# Altium schematic sheet USB Type C.SchDoc: USB Type C
size Tabloid; ApprovedBy: NA; CompanyName: Cospan Design LLC; DrawnBy: David McCoy; Engineer: David McCoy; DocumentNumber: 6; Revision: D; SheetNumber: 6; SheetTotal: 18; Client: OSH; ProjectPrettyName: Guppy Buddy; Project: Guppy Buddy
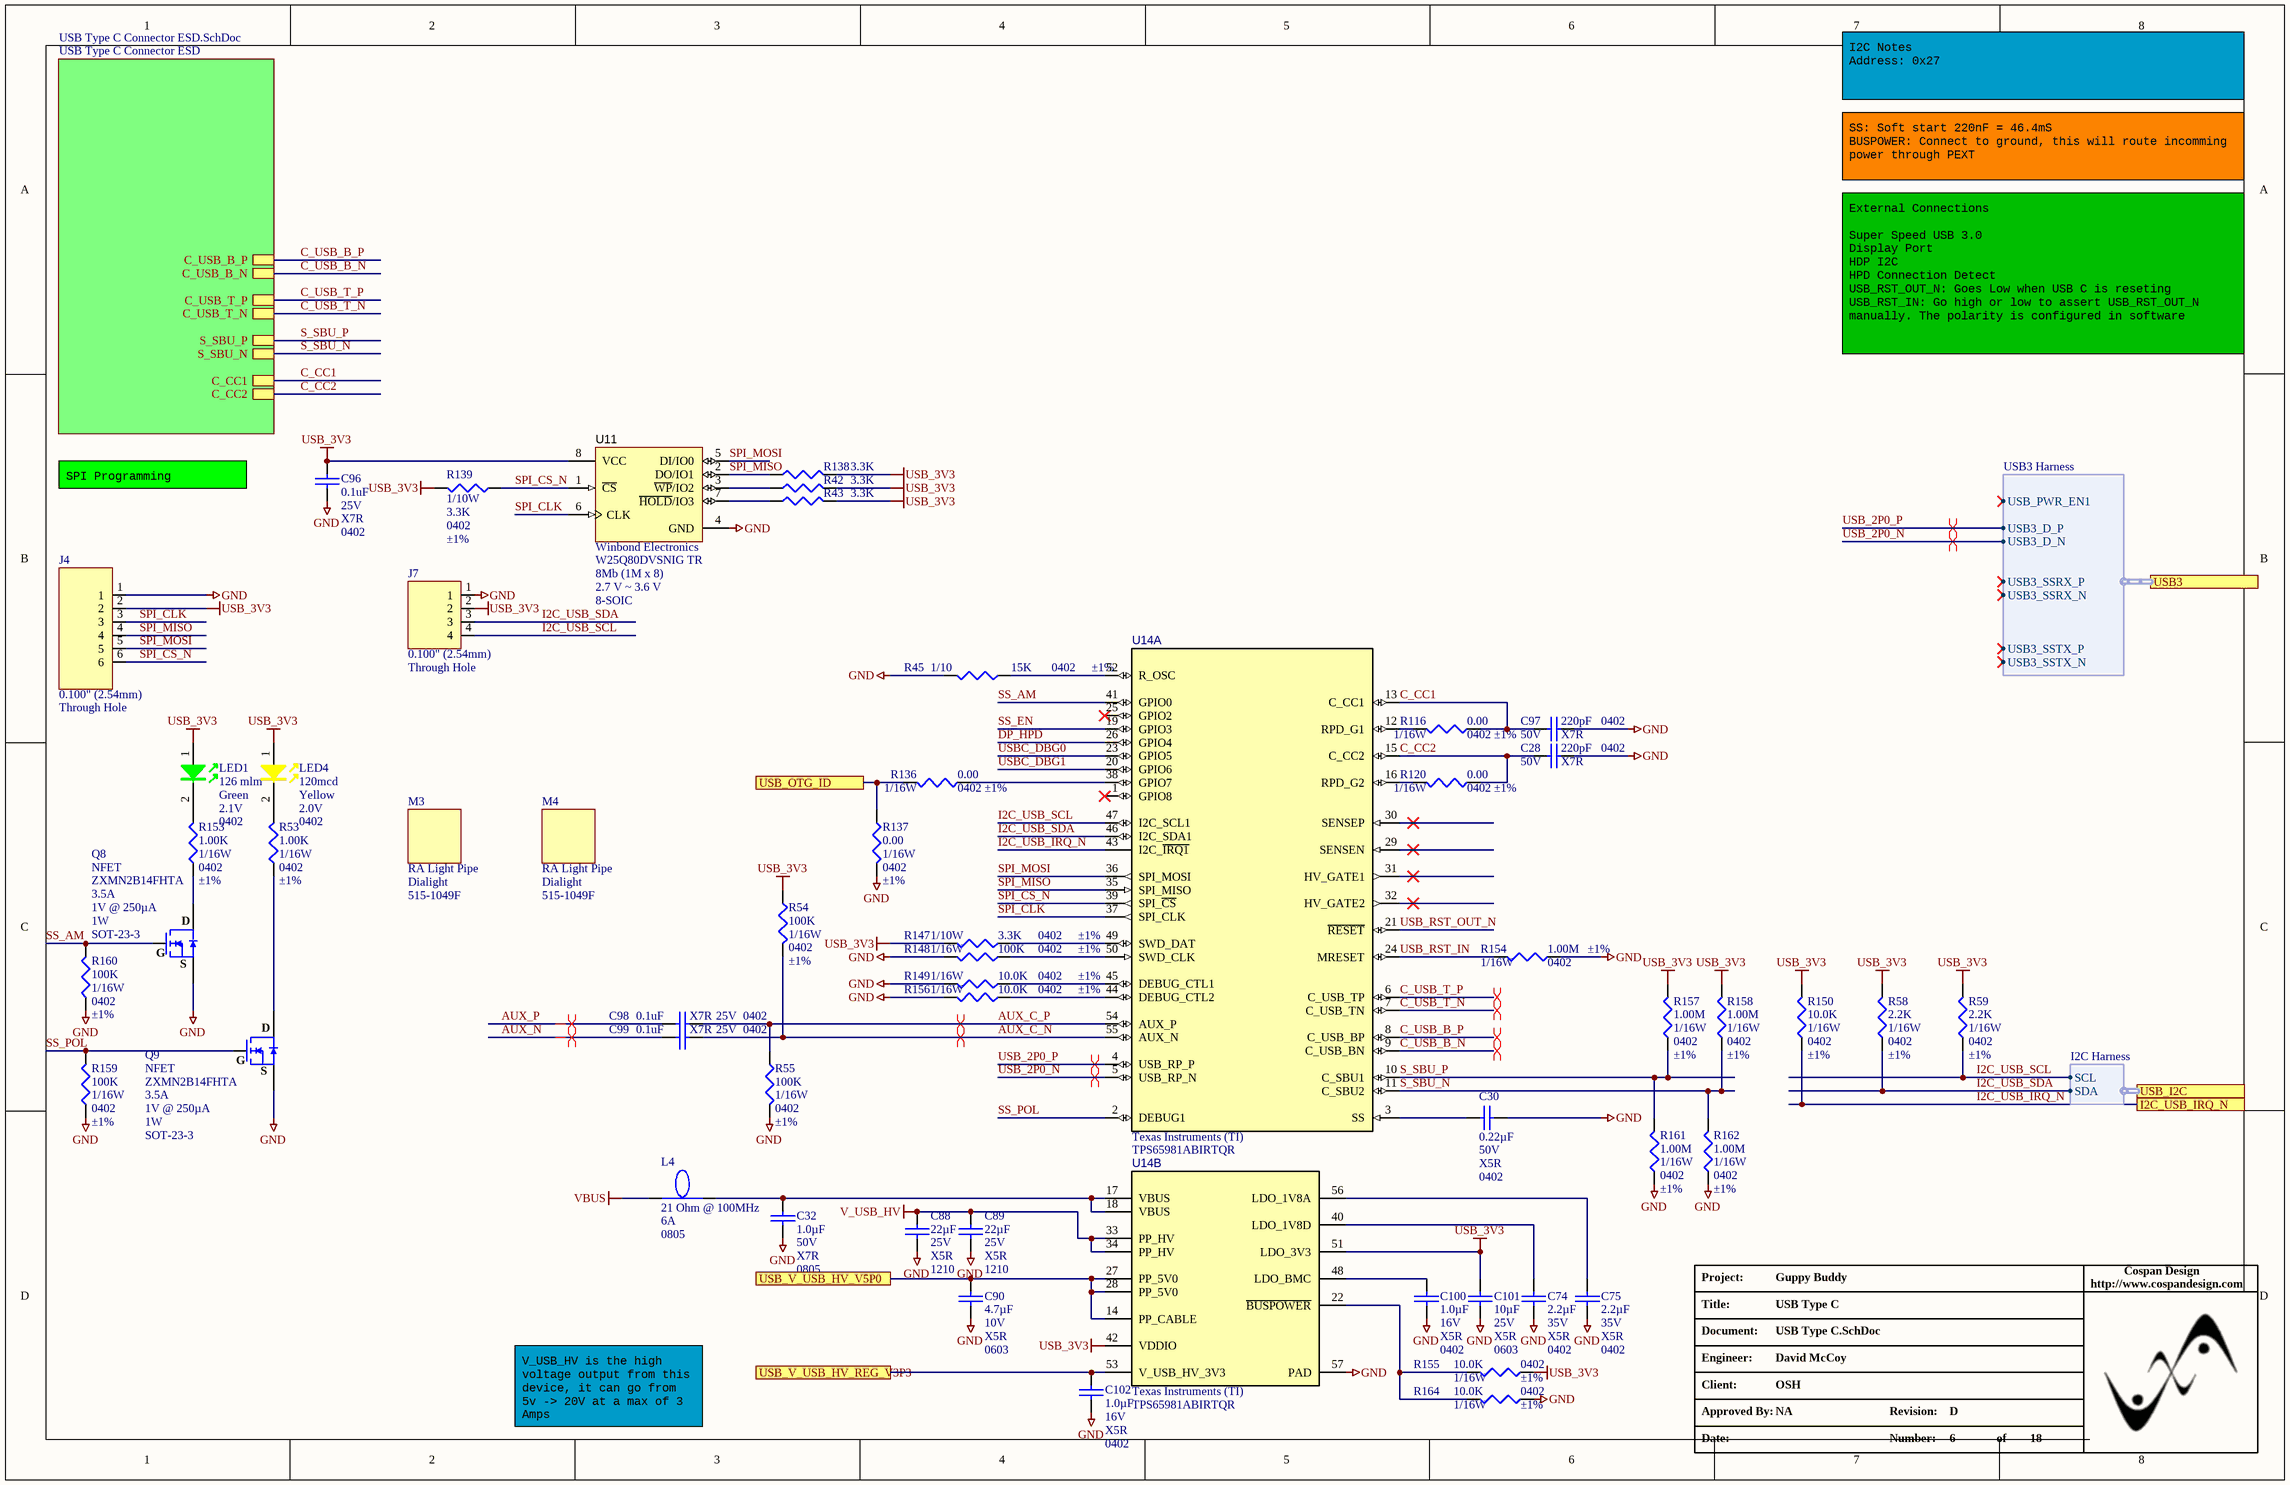
[diagram p0: USB Type C.SchDoc]

## Parts
C28  Voltage - Rated: 50V  Temperature Coefficient: X7R  Package / Case: 0402  [C_0402]  (hidden comment: 220pF)
C30  Capacitance: 0.22µF  Voltage - Rated: 50V  Temperature Coefficient: X5R  Package / Case: 0402  [C_0402]  (hidden comment: C_0402_0.22UF_50V)
C32  Capacitance: 1.0µF  Voltage - Rated: 50V  Temperature Coefficient: X7R  Package / Case: 0805  [C_ERA-0805]  (hidden comment: 1.0uF)
C74  Capacitance: 2.2µF  Voltage - Rated: 35V  Temperature Coefficient: X5R  Package / Case: 0402  [C_0402]  (hidden comment: C_0402_2.2uF_35V)
C75  Capacitance: 2.2µF  Voltage - Rated: 35V  Temperature Coefficient: X5R  Package / Case: 0402  [C_0402]  (hidden comment: C_0402_2.2uF_35V)
C88  Voltage - Rated: 25V  Temperature Coefficient: X5R  Package / Case: 1210  [C_14-1210]  (hidden comment: 22µF)
C89  Voltage - Rated: 25V  Temperature Coefficient: X5R  Package / Case: 1210  [C_14-1210]  (hidden comment: 22µF)
C90  Voltage - Rated: 10V  Temperature Coefficient: X5R  Package / Case: 0603  [C_0603]  (hidden comment: 4.7µF)
C96  Capacitance: 0.1uF  Voltage - Rated: 25V  Temperature Coefficient: X7R  Package / Case: 0402  [C_0402]  (hidden comment: C_0402_0.1UF_25V)
C97  Voltage - Rated: 50V  Temperature Coefficient: X7R  Package / Case: 0402  [C_0402]  (hidden comment: 220pF)
C98  Capacitance: 0.1uF  Voltage - Rated: 25V  Temperature Coefficient: X7R  Package / Case: 0402  [C_0402]  (hidden comment: C_0402_0.1UF_25V)
C99  Capacitance: 0.1uF  Voltage - Rated: 25V  Temperature Coefficient: X7R  Package / Case: 0402  [C_0402]  (hidden comment: C_0402_0.1UF_25V)
C100  Capacitance: 1.0µF  Voltage - Rated: 16V  Temperature Coefficient: X5R  Package / Case: 0402  [C_0402]  (hidden comment: 1.0uF)
C101  Capacitance: 10µF  Voltage - Rated: 25V  Temperature Coefficient: X5R  Package / Case: 0603  [C_ERA-0603]  (hidden comment: C_0603_10µF)
C102  Capacitance: 1.0µF  Voltage - Rated: 16V  Temperature Coefficient: X5R  Package / Case: 0402  [C_0402]  (hidden comment: 1.0uF)
J4  Pitch: 0.100" (2.54mm)  Mounting Type: Through Hole  [HDR_1X6]  (hidden comment: J_HDR1X6_THRHOLE_VERT)
J7  Pitch: 0.100" (2.54mm)  Mounting Type: Through Hole  [HDR_1X4]  (hidden comment: J_HDR1X4_THRHOLE_VERT)
L4  Impedance @ Frequency: 21 Ohm @ 100MHz  Current Rating: 6A  Package / Case: 0805  [C_ERA-0805]  (hidden comment: L_FB_21OHM_100MHZ)
LED1  Luminous Flux @ Current - Test: 126 mlm  Color: Green  Voltage - Forward (Vf) Typ: 2.1V  Package / Case: 0402  [DIOM1005X07L_GREEN]  (hidden comment: LED_GRN_0402)
LED4  Millicandela Rating: 120mcd  Color: Yellow  Voltage - Forward (Vf) Typ: 2.0V  Package / Case: 0402  [DIOM1005X07L_YELLOW]  (hidden comment: LED_YLW_0402)
M3  RA Light Pipe  Manufacturer 1: Dialight  Manufacturer Part Number 1: 515-1049F  [RA_LIGHTPIPE]
M4  RA Light Pipe  Manufacturer 1: Dialight  Manufacturer Part Number 1: 515-1049F  [RA_LIGHTPIPE]
Q8  NFET  Manufacturer Part Number: ZXMN2B14FHTA  Current - Continuous Drain (Id) @ 25° C: 3.5A  Vgs(th) (Max) @ Id: 1V @ 250µA  Power - Max: 1W  Package / Case: SOT-23-3  [SOT-23A]
Q9  NFET  Manufacturer Part Number: ZXMN2B14FHTA  Current - Continuous Drain (Id) @ 25° C: 3.5A  Vgs(th) (Max) @ Id: 1V @ 250µA  Power - Max: 1W  Package / Case: SOT-23-3  [SOT-23A]
R42  Resistance In Ohms: 3.3K  [R_0402]  (hidden comment: 3.3k Ohms)
R43  Resistance In Ohms: 3.3K  [R_0402]  (hidden comment: 3.3k Ohms)
R45  Resistance In Ohms: 15K  Power (Watts): 1/10  Case: 0402  Tolerance: ±1%  [R_0402]  (hidden comment: R_0402_15.0K)
R53  Resistance In Ohms: 1.00K  Power (Watts): 1/16W  Case: 0402  Tolerance: ±1%  [R_0402]  (hidden comment: 1.0k Ohms)
R54  Resistance In Ohms: 100K  Power (Watts): 1/16W  Case: 0402  Tolerance: ±1%  [R_0402]  (hidden comment: R_0402_100K)
R55  Resistance In Ohms: 100K  Power (Watts): 1/16W  Case: 0402  Tolerance: ±1%  [R_0402]  (hidden comment: R_0402_100K)
R58  Resistance In Ohms: 2.2K  Power (Watts): 1/16W  Case: 0402  Tolerance: ±1%  [R_0402]  (hidden comment: R_0402_2.2K)
R59  Resistance In Ohms: 2.2K  Power (Watts): 1/16W  Case: 0402  Tolerance: ±1%  [R_0402]  (hidden comment: R_0402_2.2K)
R116  Resistance In Ohms: 0.00  Power (Watts): 1/16W  Case: 0402  Tolerance: ±1%  [R_0402]  (hidden comment: 0.0 Ohms)
R120  Resistance In Ohms: 0.00  Power (Watts): 1/16W  Case: 0402  Tolerance: ±1%  [R_0402]  (hidden comment: 0.0 Ohms)
R136  Resistance In Ohms: 0.00  Power (Watts): 1/16W  Case: 0402  Tolerance: ±1%  [R_0402]  (hidden comment: 0.0 Ohms)
R137  Resistance In Ohms: 0.00  Power (Watts): 1/16W  Case: 0402  Tolerance: ±1%  [R_0402]  (hidden comment: 0.0 Ohms)
R138  Resistance In Ohms: 3.3K  [R_0402]  (hidden comment: 3.3k Ohms)
R139  Power (Watts): 1/10W  Resistance In Ohms: 3.3K  Case: 0402  Tolerance: ±1%  [R_0402]  (hidden comment: 3.3k Ohms)
R147  Power (Watts): 1/10W  Resistance In Ohms: 3.3K  Case: 0402  Tolerance: ±1%  [R_0402]  (hidden comment: 3.3k Ohms)
R148  Resistance In Ohms: 100K  Power (Watts): 1/16W  Case: 0402  Tolerance: ±1%  [R_0402]  (hidden comment: R_0402_100K)
R149  Resistance In Ohms: 10.0K  Power (Watts): 1/16W  Case: 0402  Tolerance: ±1%  [R_0402]  (hidden comment: R_0402_10.0K)
R150  Resistance In Ohms: 10.0K  Power (Watts): 1/16W  Case: 0402  Tolerance: ±1%  [R_0402]  (hidden comment: R_0402_10.0K)
R153  Resistance In Ohms: 1.00K  Power (Watts): 1/16W  Case: 0402  Tolerance: ±1%  [R_0402]  (hidden comment: 1.0k Ohms)
R154  Resistance In Ohms: 1.00M  Power (Watts): 1/16W  Case: 0402  Tolerance: ±1%  [R_0402]  (hidden comment: 1.0M Ohms)
R155  Resistance In Ohms: 10.0K  Power (Watts): 1/16W  Case: 0402  Tolerance: ±1%  [R_0402]  (hidden comment: R_0402_10.0K)
R156  Resistance In Ohms: 10.0K  Power (Watts): 1/16W  Case: 0402  Tolerance: ±1%  [R_0402]  (hidden comment: R_0402_10.0K)
R157  Resistance In Ohms: 1.00M  Power (Watts): 1/16W  Case: 0402  Tolerance: ±1%  [R_0402]  (hidden comment: 1.0M Ohms)
R158  Resistance In Ohms: 1.00M  Power (Watts): 1/16W  Case: 0402  Tolerance: ±1%  [R_0402]  (hidden comment: 1.0M Ohms)
R159  Resistance In Ohms: 100K  Power (Watts): 1/16W  Case: 0402  Tolerance: ±1%  [R_0402]  (hidden comment: R_0402_100.0K)
R160  Resistance In Ohms: 100K  Power (Watts): 1/16W  Case: 0402  Tolerance: ±1%  [R_0402]  (hidden comment: R_0402_100.0K)
R161  Resistance In Ohms: 1.00M  Power (Watts): 1/16W  Case: 0402  Tolerance: ±1%  [R_0402]  (hidden comment: 1.0M Ohms)
R162  Resistance In Ohms: 1.00M  Power (Watts): 1/16W  Case: 0402  Tolerance: ±1%  [R_0402]  (hidden comment: 1.0M Ohms)
R164  Resistance In Ohms: 10.0K  Power (Watts): 1/16W  Case: 0402  Tolerance: ±1%  [R_0402]  (hidden comment: R_0402_10.0K)
U11  Manufacturer: Winbond Electronics  Manufacturer Part Number: W25Q80DVSNIG TR  Memory Size: 8Mb (1M x 8)  Voltage - Supply: 2.7 V ~ 3.6 V  Supplier Device Package: 8-SOIC  [SOIC-8 - TI]  (hidden comment: U_W25Q80DVSNIG)
U14  Manufacturer: Texas Instruments (TI)  Manufacturer Part Number: TPS65981ABIRTQR  [RWE0056B]  (parts A,B of 2)

## Sub-sheets
USB Type C Connector ESD.SchDoc = USB Type C Connector ESD: S_SBU_P, S_SBU_N, C_USB_B_P, C_USB_B_N, C_CC1, C_USB_T_P, C_USB_T_N, C_CC2

## Ports
I2C_USB_IRQ_N, USB3 (harness USB3 Harness), USB_I2C (harness I2C Harness), USB_OTG_ID, USB_V_USB_HV_REG_V3P3, USB_V_USB_HV_V5P0

## Harnesses
USB3 Harness: USB3_D_P, USB3_D_N, USB3_SSTX_P, USB3_SSTX_N, USB3_SSRX_P, USB3_SSRX_N, USB_PWR_EN1
I2C Harness: SCL, SDA

## Nets
GND: C28.1 C30.1 C32.1 C74.1 C75.1 C88.1 C89.1 C90.1 C96.1 C97.1 C100.1 C101.1 C102.1 J4.1 J7.1 Q8.2(S) Q9.2(S) R45.1 R55.1 R137.1 R148.1 R149.1 R154.2 R156.1 R159.2 R160.2 R161.2 R162.2 R164.2 U11.4(GND) U14.57(PAD)
USB_3V3: C96.2 C101.2 J4.2 J7.2 LED1.1 LED4.1 R42.1 R43.1 R54.2 R58.1 R59.1 R138.1 R139.1 R147.1 R150.1 R155.2 R157.1 R158.1 U11.8(VCC) U14.42(VDDIO) U14.51(LDO_3V3)
V_USB_HV: C88.2 C89.2 U14.33(PP_HV) U14.34(PP_HV)
VBUS: L4.1
AUX_C_N: C99.1 R54.1 U14.55(AUX_N)
AUX_C_P: C98.1 R55.2 U14.54(AUX_P)
AUX_N: C99.2
AUX_P: C98.2
C_CC1: C97.2 R116.2 U14.13(C_CC1) ; sheet USB Type C Connector ESD.SchDoc/C_CC1
C_CC2: C28.2 R120.2 U14.15(C_CC2) ; sheet USB Type C Connector ESD.SchDoc/C_CC2
C_USB_B_N: U14.9(C_USB_BN) ; sheet USB Type C Connector ESD.SchDoc/C_USB_B_N
C_USB_B_P: U14.8(C_USB_BP) ; sheet USB Type C Connector ESD.SchDoc/C_USB_B_P
C_USB_T_N: U14.7(C_USB_TN) ; sheet USB Type C Connector ESD.SchDoc/C_USB_T_N
C_USB_T_P: U14.6(C_USB_TP) ; sheet USB Type C Connector ESD.SchDoc/C_USB_T_P
DP_HPD: U14.26(GPIO4)
I2C_USB_IRQ_N: R150.2 U14.43(I2C_~{IRQ1}) ; port I2C_USB_IRQ_N
I2C_USB_SCL: J7.4 R59.2 U14.47(I2C_SCL1) ; port USB_I2C.SCL
I2C_USB_SDA: J7.3 R58.2 U14.46(I2C_SDA1) ; port USB_I2C.SDA
S_SBU_N: R158.2 R162.1 U14.11(C_SBU2) ; sheet USB Type C Connector ESD.SchDoc/S_SBU_N
S_SBU_P: R157.2 R161.1 U14.10(C_SBU1) ; sheet USB Type C Connector ESD.SchDoc/S_SBU_P
SPI_CLK: J4.3 U11.6(CLK) U14.37(SPI_CLK)
SPI_CS_N: J4.6 R139.2 U11.1(~{CS}) U14.39(SPI_~{CS})
SPI_MISO: J4.4 R138.2 U11.2(DO/IO1) U14.35(SPI_MISO)
SPI_MOSI: J4.5 U11.5(DI/IO0) U14.36(SPI_MOSI)
SS_AM: Q8.1(G) R160.1 U14.41(GPIO0)
SS_EN: U14.19(GPIO3)
SS_POL: Q9.1(G) R159.1 U14.2(DEBUG1)
USB_2P0_N: U14.5(USB_RP_N) ; port USB3.USB3_D_N
USB_2P0_P: U14.4(USB_RP_P) ; port USB3.USB3_D_P
USB_OTG_ID: R136.1 R137.2 ; port USB_OTG_ID
USB_RST_IN: R154.1 U14.24(MRESET)
USB_RST_OUT_N: U14.21(~{RESET})
USB_V_USB_HV_REG_V3P3: C102.2 U14.53(V_USB_HV_3V3) ; port USB_V_USB_HV_REG_V3P3
USB_V_USB_HV_V5P0: C90.2 U14.14(PP_CABLE) U14.27(PP_5V0) U14.28(PP_5V0) ; port USB_V_USB_HV_V5P0
USBC_DBG0: U14.23(GPIO5)
USBC_DBG1: U14.20(GPIO6)
NetC30_2: C30.2 U14.3(SS)
NetC32_2: C32.2 L4.2 U14.17(VBUS) U14.18(VBUS)
NetC74_2: C74.2 U14.40(LDO_1V8D)
NetC75_2: C75.2 U14.56(LDO_1V8A)
NetC100_2: C100.2 U14.48(LDO_BMC)
NetLED1_2: LED1.2 R153.1
NetLED4_2: LED4.2 R53.1
NetQ8_3: Q8.3(D) R153.2
NetQ9_3: Q9.3(D) R53.2
NetR42_2: R42.2 U11.3(~{WP}/IO2)
NetR43_2: R43.2 U11.7(~{HOLD}/IO3)
NetR45_2: R45.2 U14.52(R_OSC)
NetR116_1: R116.1 U14.12(RPD_G1)
NetR120_1: R120.1 U14.16(RPD_G2)
NetR136_2: R136.2 U14.38(GPIO7)
NetR147_2: R147.2 U14.49(SWD_DAT)
NetR148_2: R148.2 U14.50(SWD_CLK)
NetR149_2: R149.2 U14.45(DEBUG_CTL1)
NetR155_1: R155.1 R164.1 U14.22(~{BUSPOWER})
NetR156_2: R156.2 U14.44(DEBUG_CTL2)

Not connected (* = marked no-connect by the designer): U14 1(GPIO8)* 25(GPIO2)* 29(SENSEN)* 30(SENSEP)* 31(HV_GATE1)* 32(HV_GATE2)*

## Layout directives
differential pair: AUX_C_N, AUX_C_P, AUX_N, AUX_P, C_USB_B_N, C_USB_B_P, C_USB_T_N, C_USB_T_P, USB_2P0_N, USB_2P0_P

## Notes on the sheet
- I2C Notes
  Address: 0x27
- SS: Soft start 220nF = 46.4mS
  BUSPOWER: Connect to ground, this will route incomming power through PEXT
- External Connections
  Super Speed USB 3.0
  Display Port
  HDP I2C
  HPD Connection Detect
  USB_RST_OUT_N: Goes Low when USB C is reseting
  USB_RST_IN: Go high or low to assert USB_RST_OUT_N manually. The polarity is configured in software
- SPI Programming Connector
- V_USB_HV is the high voltage output from this device, it can go from 5v -> 20V at a max of 3 Amps
- Project:
- http://www.cospandesign.com
- Cospan Design
- Document:
- Engineer:
- Title:
- Client:
- Approved By:
- Revision:
- Date:
- Number:
- of

## Library data of the parts
C28 C97 = C_0402_220PF_50V: CAP CER 220PF 50V 10% X7R 0402; Manufacturer: Murata Electronics North America; Manufacturer Part Number: GRM155R71H221KA01D; Supplier 1: Digi-Key; Supplier Part Number 1: 490-1298-1-ND; RoHS: RoHS Compliant; Category: Capacitors; Stock 1: 239876; Pricing: 10=0.034, 50=0.0272, 100=0.0204, 250=0.01476, 500=0.0109, 1000=0.00738 (USD); Tolerance: ±10%; Mounting Type: Surface Mount, MLCC; Operating Temperature: -55°C ~ 125°C; Applications: General Purpose; Ratings: -; Size / Dimension: 0.039" L x 0.020" W (1.00mm x 0.50mm); Height: -; Thickness: 0.022" (0.55mm); Lead Spacing: -; Features: -; Packaging: Cut Tape (CT); Lead Style: -; ComponentLink1URL: http://search.murata.co.jp/Ceramy/image/img/PDF/ENG/GRM155R71H221KA01.pdf; ComponentLink1Description: http://search.murata.co.jp/Ceramy/image/img/PDF/ENG/GRM155R71H221KA01.pdf; Capacitance: 220pF
C30 = C_0402_0.22UF_50V: CAP CER 0.22UF 50V X5R 0402; Manufacturer: Taiyo Yuden; Manufacturer Part Number: UMK105BJ224KV-F; Tolerance: ±10%; Supplier 1: Digi-Key; RoHS: RoHS Compliant; Category: Capacitors; Stock 1: 141424; Pricing 1: 1=0.35, 10=0.263, 50=0.1532, 100=0.1225, 250=0.08752, 500=0.0595, 1000=0.04813, 5000=0.03763 (USD); Packaging: Digi-Reel®; Mounting Type: Surface Mount, MLCC; Operating Temperature: -55°C ~ 85°C; Applications: General Purpose; Ratings: -; Size / Dimension: 0.039" L x 0.020" W (1.00mm x 0.50mm); Height - Seated (Max): -; Thickness (Max): 0.022" (0.55mm); Lead Spacing: -; Features: -; Lead Style: -; ComponentLink1URL: http://ds.yuden.co.jp/TYCOMPAS/ut/detail.do?productNo=UMK105BJ224KV-F&fileName=UMK105BJ224KV-F_SS&mode=specSheetDownload; ComponentLink1Description: http://ds.yuden.co.jp/TYCOMPAS/ut/detail.do?productNo=UMK105BJ224KV-F&fileName=UMK105BJ224KV-F_SS&mode=specSheetDownload; Supplier Part Number 1: 587-3500-6-ND
C32 = C_0805_1.0uF_50V: CAP CER 1UF 50V X7R 0805; Manufacturer 1: Samsung; Manufacturer Part Number 1: CL21B105KBFNNNG; Tolerance: 10%; Description 1: Cap Ceramic 1uF 50V X7R 10% SMD 0805 125C Embossed T/R; Material: Ceramic; Supplier 1: Digi-Key; Stock 1: 0; Pricing 1: 1=0.13, 10=0.097, 100=0.043, 500=0.03072, 1000=0.02413 (USD); Thickness: 0.053inch; Packaging: Tape and Reel; ComponentLink1URL: http://search.murata.co.jp/Ceramy/image/img/PDF/ENG/GRM21BR71H105KA12.pdf; ComponentLink1Description: http://search.murata.co.jp/Ceramy/image/img/PDF/ENG/GRM21BR71H105KA12.pdf; Supplier Part Number 1: 1276-6470-6-ND; Mount: Surface Mount; Case/Package: 0805; Case Code (Metric): 2012; Case Code (Imperial): 0805; Contact Plating: Nickel,Tin; Min Operating Temperature: -55°C; Max Operating Temperature: 125°C; Voltage Rating: 50V; Package Quantity: 3000; Dielectric: X7R; Termination: Wraparound; Voltage: 50V; Length: 2mm; Width: 0.049inch; Depth: 1.25mm; ComponentLink2URL: https://datasheet.ciiva.com/16428/cl05b104kq5nnnc-16428872.pdf; ComponentLink2Description: https://datasheet.ciiva.com/16428/cl05b104kq5nnnc-16428872.pdf; ComponentLink3URL: https://datasheet.ciiva.com/26310/mlcc-catalogdownload2013-eng-26310125.pdf; ComponentLink3Description: https://datasheet.ciiva.com/26310/mlcc-catalogdownload2013-eng-26310125.pdf; ComponentLink4URL: https://datasheet.ciiva.com/25733/cl21b105kbfnnng-25733278.pdf; ComponentLink4Description: https://datasheet.ciiva.com/25733/cl21b105kbfnnng-25733278.pdf; ComponentLink5URL: https://datasheet.ciiva.com/29199/455898-da-01-en-vs-kondensator-0805-29199201.pdf; ComponentLink5Description: https://datasheet.ciiva.com/29199/455898-da-01-en-vs-kondensator-0805-29199201.pdf
C74 C75 = C_0402_2.2uF_35V: CAP CER 2.2UF 35V 20% X5R 0402; Manufacturer: TDK Corporation; Manufacturer Part Number: C1005X5R1V225K050BC; Tolerance: ±10%; Supplier 1: Digi-Key; RoHS: RoHS Compliant; Category: Capacitors; Stock 1: 300469; Pricing 1: 1=0.36, 10=0.253, 100=0.1518, 500=0.11386, 1000=0.09614, 2500=0.09108, 5000=0.08602 (USD); Packaging: Cut Tape (CT); Part Status: Active; Operating Temperature: -55°C ~ 85°C; Features: Low ESL; Ratings: -; Applications: General Purpose; Failure Rate: -; Mounting Type: Surface Mount, MLCC; Size / Dimension: 0.039" L x 0.020" W (1.00mm x 0.50mm); Height - Seated (Max): -; Thickness (Max): 0.022" (0.55mm); Lead Spacing: -; Lead Style: -; ComponentLink1URL: https://product.tdk.com/info/en/catalog/datasheets/mlcc_commercial_general_en.pdf; ComponentLink1Description: https://product.tdk.com/info/en/catalog/datasheets/mlcc_commercial_general_en.pdf; Supplier Part Number 1: 445-9028-1-ND
C88 C89 = C_1210_22µF: CAP CER 22UF 25V 20% X5R 1210; Manufacturer: Taiyo Yuden; Manufacturer Part Number: TMK325BJ226MM-T; Supplier 1: Digi-Key; Supplier Part Number 1: 587-2086-1-ND; RoHS: RoHS Compliant; Category: Capacitors; Stock 1: 53533; Pricing: 1=0.86, 10=0.731, 50=0.5382, 100=0.4278, 250=0.3588 (USD); Tolerance: ±20%; Mounting Type: Surface Mount, MLCC; Operating Temperature: -55°C ~ 85°C; Applications: General Purpose; Ratings: -; Size / Dimension: 0.126" L x 0.098" W (3.20mm x 2.50mm); Height - Seated (Max): -; Thickness (Max): 0.106" (2.70mm); Lead Spacing: -; Features: -; Packaging: Cut Tape (CT); Lead Style: -; ComponentLink1URL: http://www.yuden.co.jp/productdata/catalog/en/mlcc01_e.pdf; ComponentLink1Description: http://www.yuden.co.jp/productdata/catalog/en/mlcc01_e.pdf; Capacitance: 22µF
C90 = C_0603_4.7uF_10V: CAP CER 4.7UF 10V X5R 0603; Manufacturer 1: Murata; Manufacturer Part Number 1: GRM188R6YA475KE15D; Tolerance: 10%; Description 1: 4.7µF ±10% 35V X5R Ceramic Capacitor -55°C ~ 85°C Surface Mount, MLCC 0603 (1608 Metric) 0.063" L x 0.031" W (1.60mm x 0.80mm); Material: Ceramic; Voltage Rating: 35V; Supplier 1: Digi-Key; Stock 1: 0; Pricing 1: 1=0.57, 10=0.397, 100=0.2381, 500=0.17854, 1000=0.15077 (USD); Thickness: 0.031inch; Packaging: Tape and Reel; ComponentLink1URL: http://search.murata.co.jp/Ceramy/image/img/A01X/G101/ENG/GRM188R61A475KE15-01.pdf; ComponentLink1Description: http://search.murata.co.jp/Ceramy/image/img/A01X/G101/ENG/GRM188R61A475KE15-01.pdf; Supplier Part Number 1: 490-7205-6-ND; Capacitance: 4.7µF; ComponentLink2URL: https://datasheet.ciiva.com/46444/1769893-46444984.pdf; ComponentLink2Description: https://datasheet.ciiva.com/46444/1769893-46444984.pdf; ComponentLink3URL: https://datasheet.ciiva.com/46444/1769893-46444985.pdf; ComponentLink3Description: https://datasheet.ciiva.com/46444/1769893-46444985.pdf; ComponentLink4URL: https://datasheet.ciiva.com/14906/partnumbering-e-01-14906426.pdf; ComponentLink4Description: https://datasheet.ciiva.com/14906/partnumbering-e-01-14906426.pdf; ComponentLink5URL: https://datasheet.ciiva.com/14906/partnumbering-e-01-14906427.pdf; ComponentLink5Description: https://datasheet.ciiva.com/14906/partnumbering-e-01-14906427.pdf; ComponentLink6URL: https://datasheet.ciiva.com/14906/partnumbering-e-01-14906428.pdf; ComponentLink6Description: https://datasheet.ciiva.com/14906/partnumbering-e-01-14906428.pdf; Mount: Surface Mount; Case/Package: 0603; Weight: 0.000222oz; Case Code (Metric): 1608; Case Code (Imperial): 0603; Min Operating Temperature: -55°C; Max Operating Temperature: 85°C; Package Quantity: 4000; Dielectric: X5R; Voltage: 35V; Termination: SMD/SMT; Composition: Ceramic; Voltage Rating (DC): 35V; Length: 1.6mm; Height: 0.8mm; Width: 0.8mm; Depth: 0.8mm; REACH SVHC: No SVHC; Lead Free: Lead Free
C96 C98 C99 = C_0402_0.1UF_25V: CAP CER 0.1UF 25V X6S 0402; Manufacturer 1: Yageo; Manufacturer Part Number 1: CC0402KRX7R8BB104; Description 1: Cap Ceramic 0.1uF 25V X7R 10% SMD 0402 125C Paper T/R; Tolerance: 10%; Dissipation Factor: 3.5%; ComponentLink1URL: https://product.tdk.com/info/en/catalog/datasheets/mlcc_commercial_general_en.pdf; ComponentLink1Description: https://product.tdk.com/info/en/catalog/datasheets/mlcc_commercial_general_en.pdf; Supplier 1: Digi-Key; Supplier Part Number 1: 311-2077-1-ND; Stock 1: 0; Pricing 1: 1=0.1, 10=0.048, 100=0.0215, 500=0.01534, 1000=0.01205, 2500=0.01095, 5000=0.01007 (USD); Mount: Surface Mount; Case/Package: 0402; Case Code (Imperial): 0402; Case Code (Metric): 1005; Min Operating Temperature: -55°C; Max Operating Temperature: 125°C; Voltage Rating: 25V; Voltage Rating (DC): 25V; Packaging: Tape and Reel; Dielectric: X7R; Termination: SMD/SMT; Composition: Ceramic; Length: 1mm; Height: 0.5mm; Width: 0.02inch; Thickness: 0.022inch; Depth: 0.5mm; Radiation Hardening: No; Lead Free: Lead Free; Halogen Free: Halogen Free; ComponentLink2URL: https://datasheet.ciiva.com/11464/upy-gphc-x7r-6-3v-to-50v-8-11464889.pdf; ComponentLink2Description: https://datasheet.ciiva.com/11464/upy-gphc-x7r-6-3v-to-50v-8-11464889.pdf; ComponentLink3URL: https://datasheet.ciiva.com/13210/upy-gphc-x7r-6-3v-to-50v-8-12304-13210908.pdf; ComponentLink3Description: https://datasheet.ciiva.com/13210/upy-gphc-x7r-6-3v-to-50v-8-12304-13210908.pdf; ComponentLink4URL: https://datasheet.ciiva.com/17437/upy-gphc-x7r-6-3v-to-50v-8-17437357.pdf; ComponentLink4Description: https://datasheet.ciiva.com/17437/upy-gphc-x7r-6-3v-to-50v-8-17437357.pdf
C100 C102 = C_0402_1.0UF_16V: CAP CER 1.0UF 16V X5R 0402; Manufacturer 1: Samsung; Manufacturer Part Number 1: CL05A105KO5NNNC; Tolerance: 10%; Description 1: Cap Ceramic 1uF 16V X5R 10% SMD 0402 85C Paper T/R; Supplier 1: Digi-Key; Stock 1: 26908; Pricing 1: 1=0.1, 10=0.062, 100=0.0276, 500=0.01968, 1000=0.01547, 2500=0.01406, 5000=0.01294 (USD); Packaging: Tape and Reel; ComponentLink1URL: http://ds.yuden.co.jp/TYCOMPAS/ut/detail.do?productNo=EMK105BJ105KV-F&fileName=EMK105BJ105KV-F_SS&mode=specSheetDownload; ComponentLink1Description: http://ds.yuden.co.jp/TYCOMPAS/ut/detail.do?productNo=EMK105BJ105KV-F&fileName=EMK105BJ105KV-F_SS&mode=specSheetDownload; Supplier Part Number 1: 1276-1067-6-ND; ComponentLink2URL: https://datasheet.ciiva.com/16207/cl05a105ko5nnnc-16207571.pdf; ComponentLink2Description: https://datasheet.ciiva.com/16207/cl05a105ko5nnnc-16207571.pdf; ComponentLink3URL: https://datasheet.ciiva.com/15195/getdatasheetpartid-355272-15195629.pdf; ComponentLink3Description: https://datasheet.ciiva.com/15195/getdatasheetpartid-355272-15195629.pdf; Mount: Surface Mount; Case/Package: 0402; Case Code (Metric): 1005; Case Code (Imperial): 0402; Contact Plating: Tin; Min Operating Temperature: -55°C; Max Operating Temperature: 85°C; Dielectric: X5R; Package Quantity: 1; Voltage Rating: 16V; Voltage: 16V; Length: 1mm; Height: 0.5mm; Width: 0.02inch; Thickness: 0.022inch; Depth: 0.5mm; Radiation Hardening: No
C101 = C_0603_10µF: CAP CER 10UF 16V X5R 0603; Manufacturer: Murata Electronics North America; Manufacturer Part Number: GRM188R61C106MA73D; Tolerance: ±20%; Supplier 1: Digi-Key; RoHS: RoHS Compliant; Category: Capacitors; Stock 1: 450536; Pricing 1: 1=0.35, 10=0.303, 50=0.184, 100=0.1516, 250=0.12124, 500=0.11042, 1000=0.09959 (USD); Packaging: Cut Tape (CT); Mounting Type: Surface Mount, MLCC; Operating Temperature: -55°C ~ 85°C; Applications: General Purpose; Ratings: -; Size / Dimension: 0.063" L x 0.031" W (1.60mm x 0.80mm); Height - Seated (Max): -; Thickness (Max): 0.031" (0.80mm); Lead Spacing: -; Features: -; Lead Style: -; ComponentLink1URL: http://www.murata.com/~/media/webrenewal/support/library/catalog/products/capacitor/mlcc/c02e.pdf; ComponentLink1Description: http://www.murata.com/~/media/webrenewal/support/library/catalog/products/capacitor/mlcc/c02e.pdf; Supplier Part Number 1: 490-7201-1-ND
J4 = J_HDR1X6_THRHOLE_VERT: CONN HEADER .100" 12POS TIN PCB; Manufacturer: Samtec; Manufacturer Part Number: TSW-106-07-T-S; Connector Type: Unshrouded; Number of Positions: 6; Number of Positions Loaded: All; Supplier 1: Samtec; Supplier Part Number 1: TSW-106-07-T-S; RoHS: RoHS Compliant; Category: Connectors, Interconnects; Stock 1: 0; Number of Rows: 1; Row Spacing: -; Height Stacking (Mating): -; Height Above Board: 0.100" (2.54mm); Contact Mating Length: 0.166" (4.22mm); Termination: Solder; Contact Finish: Tin; Contact Finish Thickness: 200µin (5.08µm); Features: -; Color: Black; Packaging: Bulk; ComponentLink1URL: http://www.samtec.com/ftppub/cpdf/TX-MKT1.PDF; ComponentLink1Description: http://www.samtec.com/ftppub/cpdf/TX-MKT1.PDF; Molding Height Above Board: 0.100" (2.54mm); ComponentLink2URL: http://www.samtec.com/ftppub/pdf/TD.PDF; ComponentLink2Description: http://www.samtec.com/ftppub/pdf/TD.PDF; Pricing: 1=0.201
J7 = J_HDR1X4_THRHOLE_VERT: CONN HEADER .100" 4POS TIN PCB; Manufacturer: Samtec; Manufacturer Part Number: TSW-104-07-T-S; Connector Type: Unshrouded; Number of Positions: 4; Number of Positions Loaded: All; Supplier 1: Samtec; Supplier Part Number 1: TSW-104-07-T-S; RoHS: RoHS Compliant; Category: Connectors, Interconnects; Number of Rows: 1; Row Spacing: -; Height Stacking (Mating): -; Height Above Board: 0.100" (2.54mm); Contact Mating Length: 0.166" (4.22mm); Termination: Solder; Contact Finish: Tin; Contact Finish Thickness: 200µin (5.08µm); Features: -; Color: Black; Packaging: Bulk; ComponentLink1URL: http://www.samtec.com/ftppub/cpdf/TX-MKT1.PDF; ComponentLink1Description: http://www.samtec.com/ftppub/cpdf/TX-MKT1.PDF; Pricing: 1=0.134
L4 = L_FB_21OHM_100MHZ: FERRITE BEAD 21 OHM 0805 1LN; Manufacturer: Taiyo Yuden; Manufacturer Part Number: FBMJ2125HM210NT; Tolerance: 30%; Impedance: 21R; Number of Lines: 1; DC Resistance (DCR): 4mR; Test Frequency: 100MHz; Shielding: Unshielded; Supplier 1: Digikey; Stock 1: 12560; Pricing 1: 1=0.12, 10=0.099, 25=0.0772, 50=0.0638, 100=0.055, 250=0.044, 500=0.0396, 1000=0.033 (USD); Case/Package: 0805; Number of Pins: 2; Core Material: Ferrite; Case Code (Metric): 2012; Case Code (Imperial): 0805; Material: Ferrite; Min Operating Temperature: -40°C; Max Operating Temperature: 125°C; Package Quantity: 1; Packaging: Tape and Reel; Max Current Rating: 6A; Max DC Current: 6A; Termination: SMD/SMT; Frequency: 100MHz; Length: 0.079inch; Height: 0.041inch; Width: 0.049inch; Depth: 1.45mm; REACH SVHC: Unknown; Lead Free: Lead Free; Halogen Free: Halogen Free; ComponentLink1URL: https://datasheet.ciiva.com/6212/fbmj2125hm210nt-ss-6212912.pdf; ComponentLink1Description: https://datasheet.ciiva.com/6212/fbmj2125hm210nt-ss-6212912.pdf; ComponentLink2URL: https://datasheet.ciiva.com/6212/chipbeads01-e-6212907.pdf; ComponentLink2Description: https://datasheet.ciiva.com/6212/chipbeads01-e-6212907.pdf; ComponentLink3URL: https://datasheet.ciiva.com/25614/0900766b810b37be-25614411.pdf; ComponentLink3Description: https://datasheet.ciiva.com/25614/0900766b810b37be-25614411.pdf; ComponentLink4URL: https://datasheet.ciiva.com/6212/chipbeads01-e-6212908.pdf; ComponentLink4Description: https://datasheet.ciiva.com/6212/chipbeads01-e-6212908.pdf; Supplier Part Number 1: 587-1765-6-ND
LED1 = LED_GRN_0402: LED 1X0.5MM 570NM GN WTR CLR SMD; Manufacturer: Kingbright Corp; Manufacturer Part Number: APHHS1005CGCK; Current - Test: 20mA; Wavelength - Peak: 574nm; Millicandela Rating: 40mcd; Lens Type: Clear; Lens Style/Size: Rectangle, 0.8mm x 0.5mm; Viewing Angle: 120°; Supplier 1: Digi-Key; Supplier Part Number 1: 754-1101-1-ND; RoHS: RoHS Compliant; Category: Optoelectronics; Stock 1: 3400; Pricing: 1=0.24, 10=0.176, 25=0.1412, 100=0.1293, 250=0.11752, 500=0.10576, 1000=0.094 (USD); Wavelength - Dominant: 570nm; Mounting Type: Surface Mount; Packaging: Cut Tape (CT); Size / Dimension: *; Height: *; ComponentLink1URL: http://www.us.kingbright.com/images/catalog/SPEC/APHHS1005CGCK.pdf; ComponentLink1Description: http://www.us.kingbright.com/images/catalog/SPEC/APHHS1005CGCK.pdf
LED4 = LED_YLW_0402: LED 1X0.5MM 590NM YW WTR CLR SMD; Manufacturer: Kingbright Corp; Manufacturer Part Number: APHHS1005SYCK; Luminous Flux @ Current - Test: 377 mlm; Current - Test: 20mA; Lens Type: Clear; Lens Style/Size: Rectangle, 0.8mm x 0.5mm; Viewing Angle: 120°; Supplier 1: Digi-Key; RoHS: RoHS Compliant; Category: Optoelectronics; Stock 1: 15829; Pricing: 1=0.26, 10=0.195, 25=0.156, 100=0.143, 250=0.13, 500=0.117, 1000=0.104 (USD); Wavelength - Dominant: 590nm; Wavelength - Peak: 590nm; Mounting Type: Surface Mount; Packaging: Cut Tape (CT); ComponentLink1URL: http://www.us.kingbright.com/images/catalog/SPEC/APHHS1005SYCK.pdf; ComponentLink1Description: http://www.us.kingbright.com/images/catalog/SPEC/APHHS1005SYCK.pdf; Supplier Part Number 1: 754-1105-1-ND
M3 M4 = M_RA_LIGHTPIPE_7513D2-S: OPTICAL LIGHT PIPE; Description 1: DIALIGHT         515-1049F             Light Pipe, 16.6 mm, Circular, 1 Pipes, Transparent, Press Fit; Lens Colour: Clear; Lens Style: Round; Number of Columns: 1; Element Configuration: Single; ComponentLink1URL: https://www.vcclite.com/wp-content/uploads/wpallimport/files/files/7513D2-S.pdf; ComponentLink1Description: https://www.vcclite.com/wp-content/uploads/wpallimport/files/files/7513D2-S.pdf; ComponentLink2URL: http://www.mouser.com/ds/2/423/7513D2-S%20Series%20BrightPipes%20Optical%20Lightpipes-552477.pdf; ComponentLink2Description: http://www.mouser.com/ds/2/423/7513D2-S%20Series%20BrightPipes%20Optical%20Lightpipes-552477.pdf; ComponentLink3URL: http://www.onlinecomponents.com/productFiles/mf-CM/1857513d2-sseriesbrightpipesopticallightpipes.pdf; ComponentLink3Description: http://www.onlinecomponents.com/productFiles/mf-CM/1857513d2-sseriesbrightpipesopticallightpipes.pdf; Stock 1: 44750; Mount: PCB,Press-Fit; Colour: Clear; Material: Polycarbonate; Packaging: Bulk; Package Quantity: 200; Number of Rows: 1; Orientation: Right Angle; Length: 16.6mm; REACH SVHC: No SVHC; Lead Free: Lead Free; ComponentLink4URL: http://www.mouser.com/ds/2/109/C16134-348814.pdf; ComponentLink4Description: http://www.mouser.com/ds/2/109/C16134-348814.pdf; ComponentLink5URL: http://www.farnell.com/cad/1924634.pdf; ComponentLink5Description: http://www.farnell.com/cad/1924634.pdf; ComponentLink6URL: http://www.onlinecomponents.com/productFiles/mf-DIA/c16134.pdf; ComponentLink6Description: http://www.onlinecomponents.com/productFiles/mf-DIA/c16134.pdf; ComponentLink7URL: http://www.dialight.com/Assets/Drawings/2D_Drawings_DrawingDetailedSpec/C16134.pdf; ComponentLink7Description: http://www.dialight.com/Assets/Drawings/2D_Drawings_DrawingDetailedSpec/C16134.pdf; ComponentLink8URL: https://www.distrelec.biz/Web/Downloads/5_/en/ljDialight_LIghtPipe-515_EN.pdf?mime=application%2Fpdf; ComponentLink8Description: https://www.distrelec.biz/Web/Downloads/5_/en/ljDialight_LIghtPipe-515_EN.pdf?mime=application%2Fpdf; ComponentLink9URL: http://uk.rs-online.com/webdocs/1383/0900766b81383d56.pdf; ComponentLink9Description: http://uk.rs-online.com/webdocs/1383/0900766b81383d56.pdf; ComponentLink10URL: http://www.dialightsignalsandcomponents.com/Assets/Brochures_And_Catalogs/Indication/Lightpipe_Selector_Guide.pdf; ComponentLink10Description: http://www.dialightsignalsandcomponents.com/Assets/Brochures_And_Catalogs/Indication/Lightpipe_Selector_Guide.pdf; Pricing 1: 1=1.56, 10=1.267, 25=0.9748, 100=0.8772, 250=0.77972, 500=0.66276, 1000=0.5458, 2500=0.51851, 5000=0.50682 (USD); Supplier 1: Digi-Key; Supplier Part Number 1: 350-2175-ND
Q8 Q9 = Q_NFET_3.50A_SOT23: MOSFET N-CH 20V 3.5A SOT23-3; Manufacturer: Diodes Incorporated; FET Type: N-Channel; Rds On (Max) @ Id, Vgs: 55 mOhm @ 3.5A, 4.5V; Current - Continuous Drain (Id) @ 25°C: 3.5A (Ta); Drive Voltage (Max Rds On,  Min Rds On): 1.8V, 4.5V; Gate Charge (Qg) (Max) @ Vgs: 11nC @ 4.5V; Input Capacitance (Ciss) (Max) @ Vds: 872pF @ 10V; Vgs (Max): ±8V; Power Dissipation (Max): 1W (Ta); Supplier 1: Digi-Key; Supplier Part Number 1: ZXMN2B14FHCT-ND; RoHS: RoHS Compliant; Category: Discrete Semiconductor Products; Stock 1: 1379; FET Feature: -; Drain to Source Voltage (Vdss): 20V; Mounting Type: Surface Mount; Supplier Device Package: SOT-23-3; Packaging: Cut Tape (CT); ComponentLink1URL: http://www.diodes.com/_files/datasheets/ZXMN2B14FH.pdf; ComponentLink1Description: http://www.diodes.com/_files/datasheets/ZXMN2B14FH.pdf; Pricing 1: 1=0.78, 10=0.683, 100=0.5238, 500=0.41406, 1000=0.33125 (USD); Part Status: Active; Technology: MOSFET (Metal Oxide); Operating Temperature: -55°C ~ 150°C (TJ)
R42 R43 R138 R139 R147 = R_0402_3.3K: RES 3.30K OHM 1/10W 1% 0402 SM; Manufacturer: Panasonic - ECG; Manufacturer Part Number: ERJ-2RKF3301X; Temperature Coefficient: ±100ppm/°C; Supplier 1: Digi-Key; Supplier Part Number 1: P3.30KLCT-ND; RoHS: RoHS Compliant; Category: Resistors; Stock 1: 246274; Pricing: 1=0.06, 50=0.0242, 100=0.0184, 250=0.01364, 500=0.01008, 1000=0.00672, 5000=0.00473 (USD); Composition: Thick Film; Features: -; Size / Dimension: 0.039" L x 0.020" W (1.00mm x 0.50mm); Height: 0.014" (0.35mm); Number of Terminations: 2; Packaging: Cut Tape (CT); Package / Case: 0402 (1005 Metric); ComponentLink1URL: http://industrial.panasonic.com/www-cgi/jvcr13pz.cgi?E+PZ+3+AOA0002+ERJ2RKF3301X+7+WW; ComponentLink1Description: http://industrial.panasonic.com/www-cgi/jvcr13pz.cgi?E+PZ+3+AOA0002+ERJ2RKF3301X+7+WW
  R42 R43 R138: Power (Watts): 1/10W; Case: 0402; Tolerance: ±1%
R45 = R_0402_15.0K: RES 15.0K OHM 1/10W 1% 0402 SMD; Manufacturer: Panasonic - ECG; Manufacturer Part Number: ERJ-2RKF1502X; Temperature Coefficient: ±100ppm/°C; Supplier 1: Digi-Key; Supplier Part Number 1: P15.0KLCT-ND; RoHS: RoHS Compliant; Category: Resistors; Stock 1: 695227; Pricing: 1=0.06, 50=0.0242, 100=0.0184, 250=0.01364, 500=0.01008, 1000=0.00672, 5000=0.00473 (USD); Resistance (Ohms): 15K; Composition: Thick Film; Features: -; Size / Dimension: 0.039" L x 0.020" W (1.00mm x 0.50mm); Height: 0.016" (0.40mm); Number of Terminations: 2; Packaging: Cut Tape (CT); Package / Case: 0402 (1005 Metric); ComponentLink1URL: http://industrial.panasonic.com/www-cgi/jvcr13pz.cgi?E+PZ+3+AOA0002+ERJ2RKF1502X+7+WW; ComponentLink1Description: http://industrial.panasonic.com/www-cgi/jvcr13pz.cgi?E+PZ+3+AOA0002+ERJ2RKF1502X+7+WW
R53 R153 = R_0402_1.0K: RES 1.00K OHM 1/16W 1% 0402 SMD; Manufacturer: Yageo; Manufacturer Part Number: RC0402FR-071KL; Resistance (Ohms): 1K; Temperature Coefficient: ±100ppm/°C; Supplier 1: Digi-Key; Supplier Part Number 1: 311-1.00KLRCT-ND; RoHS: RoHS Compliant; Category: Resistors; Stock 1: 2103351; Pricing: 10=0.014, 100=0.0063, 500=0.00382, 1000=0.0027, 5000=0.00203 (USD); Composition: Thick Film; Features: -; Package / Case: 0402 (1005 Metric); Size / Dimension: 0.039" L x 0.020" W (1.00mm x 0.50mm); Height: 0.016" (0.40mm); Number of Terminations: 2; Packaging: Cut Tape (CT); ComponentLink1URL: http://www.yageo.com/documents/recent/PYu-RC0402_51_RoHS_L_6.pdf; ComponentLink1Description: http://www.yageo.com/documents/recent/PYu-RC0402_51_RoHS_L_6.pdf
R54 R55 R148 = R_0402_100K: RES SMD 100K OHM 1% 1/16W 0402; Manufacturer: Yageo; Manufacturer Part Number: RC0402FR-07100KL; Temperature Coefficient: ±100ppm/°C; Supplier 1: Digi-Key; RoHS: RoHS Compliant; Category: Resistors; Stock 1: 4989982; Pricing 1: 1=0.1, 10=0.013, 25=0.0096, 100=0.0054, 250=0.00412, 500=0.00328, 1000=0.00242, 2500=0.0021, 5000=0.00173 (USD); Packaging: Cut Tape (CT); Resistance (Ohms): 100k; Composition: Thick Film; Features: Moisture Resistant; Operating Temperature: -55°C ~ 155°C; Package / Case: 0402 (1005 Metric); Supplier Device Package: 0402; Size / Dimension: 0.039" L x 0.020" W (1.00mm x 0.50mm); Height: 0.016" (0.40mm); Number of Terminations: 2; ComponentLink1URL: http://www.yageo.com/NewPortal/yageodocoutput?fileName=/pdf/R-Chip/PYu-RC_Group_51_RoHS_L_3.pdf; ComponentLink1Description: http://www.yageo.com/NewPortal/yageodocoutput?fileName=/pdf/R-Chip/PYu-RC_Group_51_RoHS_L_3.pdf; Supplier Part Number 1: 311-100KLRCT-ND
R58 R59 = R_0402_2.2K: RES SMD 2.2K OHM 1% 1/10W 0402; Manufacturer: Panasonic Electronic Components; Manufacturer Part Number: ERJ-2RKF2201X; Temperature Coefficient: ±100ppm/°C; Supplier 1: Digi-Key; RoHS: RoHS Compliant; Category: Resistors; Stock 1: 1256647; Pricing 1: 1=0.1, 50=0.015, 100=0.011, 250=0.0084, 500=0.00674, 1000=0.00496, 5000=0.00355 (USD); Packaging: Cut Tape (CT); Resistance (Ohms): 2.2k; Composition: Thick Film; Features: Automotive AEC-Q200; Operating Temperature: -55°C ~ 155°C; Package / Case: 0402 (1005 Metric); Supplier Device Package: 0402; Size / Dimension: 0.039" L x 0.020" W (1.00mm x 0.50mm); Height: 0.016" (0.40mm); Number of Terminations: 2; ComponentLink1URL: http://industrial.panasonic.com/www-cgi/jvcr13pz.cgi?E+PZ+3+AOA0002+ERJ2RKF2201X+7+WW; ComponentLink1Description: http://industrial.panasonic.com/www-cgi/jvcr13pz.cgi?E+PZ+3+AOA0002+ERJ2RKF2201X+7+WW; Supplier Part Number 1: P2.20KLCT-ND
R116 R120 R136 R137 = R_0402_0.00: RES 0.00 OHM 1/16W 1% 0402 SMD; Manufacturer: Yageo; Manufacturer Part Number: RC0402JR-070RL; Supplier 1: Digi-Key; RoHS: RoHS Compliant; Category: Resistors; Stock 1: 14041464; Pricing 1: 1=0.1, 10=0.01, 25=0.0068, 50=0.0052, 100=0.0038, 250=0.00288, 500=0.0023, 1000=0.0017, 5000=0.00122 (USD); Packaging: Cut Tape (CT); Part Status: Active; Composition: Thick Film; Features: Moisture Resistant; Temperature Coefficient: -; Operating Temperature: -55°C ~ 155°C; Package / Case: 0402 (1005 Metric); Supplier Device Package: 0402; Size / Dimension: 0.039" L x 0.020" W (1.00mm x 0.50mm); Height - Seated (Max): 0.016" (0.40mm); Failure Rate: -; ComponentLink1URL: http://www.yageo.com/documents/recent/PYu-RC_Group_51_RoHS_L_7.pdf; ComponentLink1Description: http://www.yageo.com/documents/recent/PYu-RC_Group_51_RoHS_L_7.pdf; Supplier Part Number 1: 311-0.0JRCT-ND
R149 R150 R155 R156 R164 = R_0402_10.0K: RES 10.0K OHM 1/16W 1% 0402 SMD; Manufacturer: Stackpole Electronics Inc; Manufacturer Part Number: RMCF0402FT10K0; Resistance (Ohms): 10k; Temperature Coefficient: ±100ppm/°C; Supplier 1: Digi-Key; Supplier Part Number 1: RMCF0402FT10K0CT-ND; RoHS: RoHS Compliant; Category: Resistors; Stock 1: 234525; Pricing: 1=0.04, 10=0.025, 50=0.0138, 100=0.0105, 250=0.0078, 500=0.00576, 1000=0.00384, 2500=0.00324, 5000=0.0027 (USD); Composition: Thick Film; Features: -; Package / Case: 0402 (1005 Metric); Size / Dimension: 0.039" L x 0.020" W (1.00mm x 0.50mm); Height: 0.016" (0.40mm); Number of Terminations: 2; Packaging: Cut Tape (CT); ComponentLink1URL: http://www.seielect.com/Catalog/SEI-RMCF_RMCP.pdf; ComponentLink1Description: http://www.seielect.com/Catalog/SEI-RMCF_RMCP.pdf
R154 R157 R158 R161 R162 = R_0402_1.0M: RES 1.00M OHM 1/16W 1% 0402 SMD; Manufacturer: Vishay/Dale; Manufacturer Part Number: CRCW04021M00FKED; Temperature Coefficient: ±100ppm/°C; Supplier 1: Digi-Key; RoHS: RoHS Compliant; Category: Resistors; Stock 1: 232720; Pricing: 10=0.083, 50=0.0444, 200=0.0255, 1000=0.0174 (USD); Composition: Thick Film; Features: -; Lead Style: Surface Mount (SMD - SMT); Packaging: Digi-Reel®; ComponentLink1URL: http://www.vishay.com/doc?20035; ComponentLink1Description: http://www.vishay.com/doc?20035; Supplier Part Number 1: 541-1.00MLDKR-ND
R159 R160 = R_0402_100.0K: RES 100K OHM 1/16W 1% 0402 SMD; Manufacturer: Stackpole Electronics Inc; Manufacturer Part Number: RMCF0402FT100K; Temperature Coefficient: ±100ppm/°C; RoHS: RoHS Compliant; Category: Resistors; Composition: Thick Film; Features: -; Lead Style: Surface Mount (SMD - SMT); Packaging: Cut Tape (CT); Resistance (Ohms): 100k; Package / Case: 0402 (1005 Metric); Supplier Device Package: 0402; Size / Dimension: 0.039" L x 0.020" W (1.00mm x 0.50mm); Height: 0.016" (0.40mm); Number of Terminations: 2; Supplier 1: Digi-Key; Supplier Part Number 1: RMCF0402FT100KCT-ND; Stock 1: 18746; Pricing: 1=0.04, 10=0.025, 50=0.0138, 100=0.0105, 250=0.0078, 500=0.00576, 1000=0.00384, 2500=0.00324, 5000=0.0027 (USD); ComponentLink1URL: http://www.seielect.com/Catalog/SEI-RMCF_RMCP.pdf; ComponentLink1Description: http://www.seielect.com/Catalog/SEI-RMCF_RMCP.pdf
U11 = U_W25Q80DVSNIG: 3V, 8Mbit, Serial Flash Memory with Dual and Qual SPI, SOIC-8; Memory Type: Non-Volatile; Write Cycle Time - Word, Page: 3ms; ComponentLink1Description: https://www.winbond.com/resource-files/w25q80dv_revg_07212015.pdf; ComponentLink1URL: https://www.winbond.com/resource-files/w25q80dv_revg_07212015.pdf; RoHS: RoHS Compliant; Supplier 1: Digi-Key; Supplier Part Number 1: W25Q80DVSNIG CT-ND; Category: Integrated Circuits (ICs); Stock 1: 48844; Pricing 1: 1=0.53 (USD); Packaging: Cut Tape (CT); Part Status: Active; Memory Format: FLASH; Technology: FLASH - NOR; Access Time: -; Memory Interface: SPI; Operating Temperature: -40°C ~ 85°C (TA); Mounting Type: Surface Mount; Package / Case: 8-SOIC (0.154", 3.90mm Width)
U14 = U_TPS65981ABQWRWERQ1: USB, Type-C Controller PMIC 56-QFN (8x8); Supplier 1: Digikey; Stock 1: 0; Pricing 1: 2000=3.0577 (USD); Number of Pins: 56; Lead Free: Lead Free; Supplier Part Number 1: TPS65981ABIRTQR-ND